# EAGLE schematic james_z80_debug_mod (EAGLE 7.7.0)

## Sheet 1 of 2: Main Board
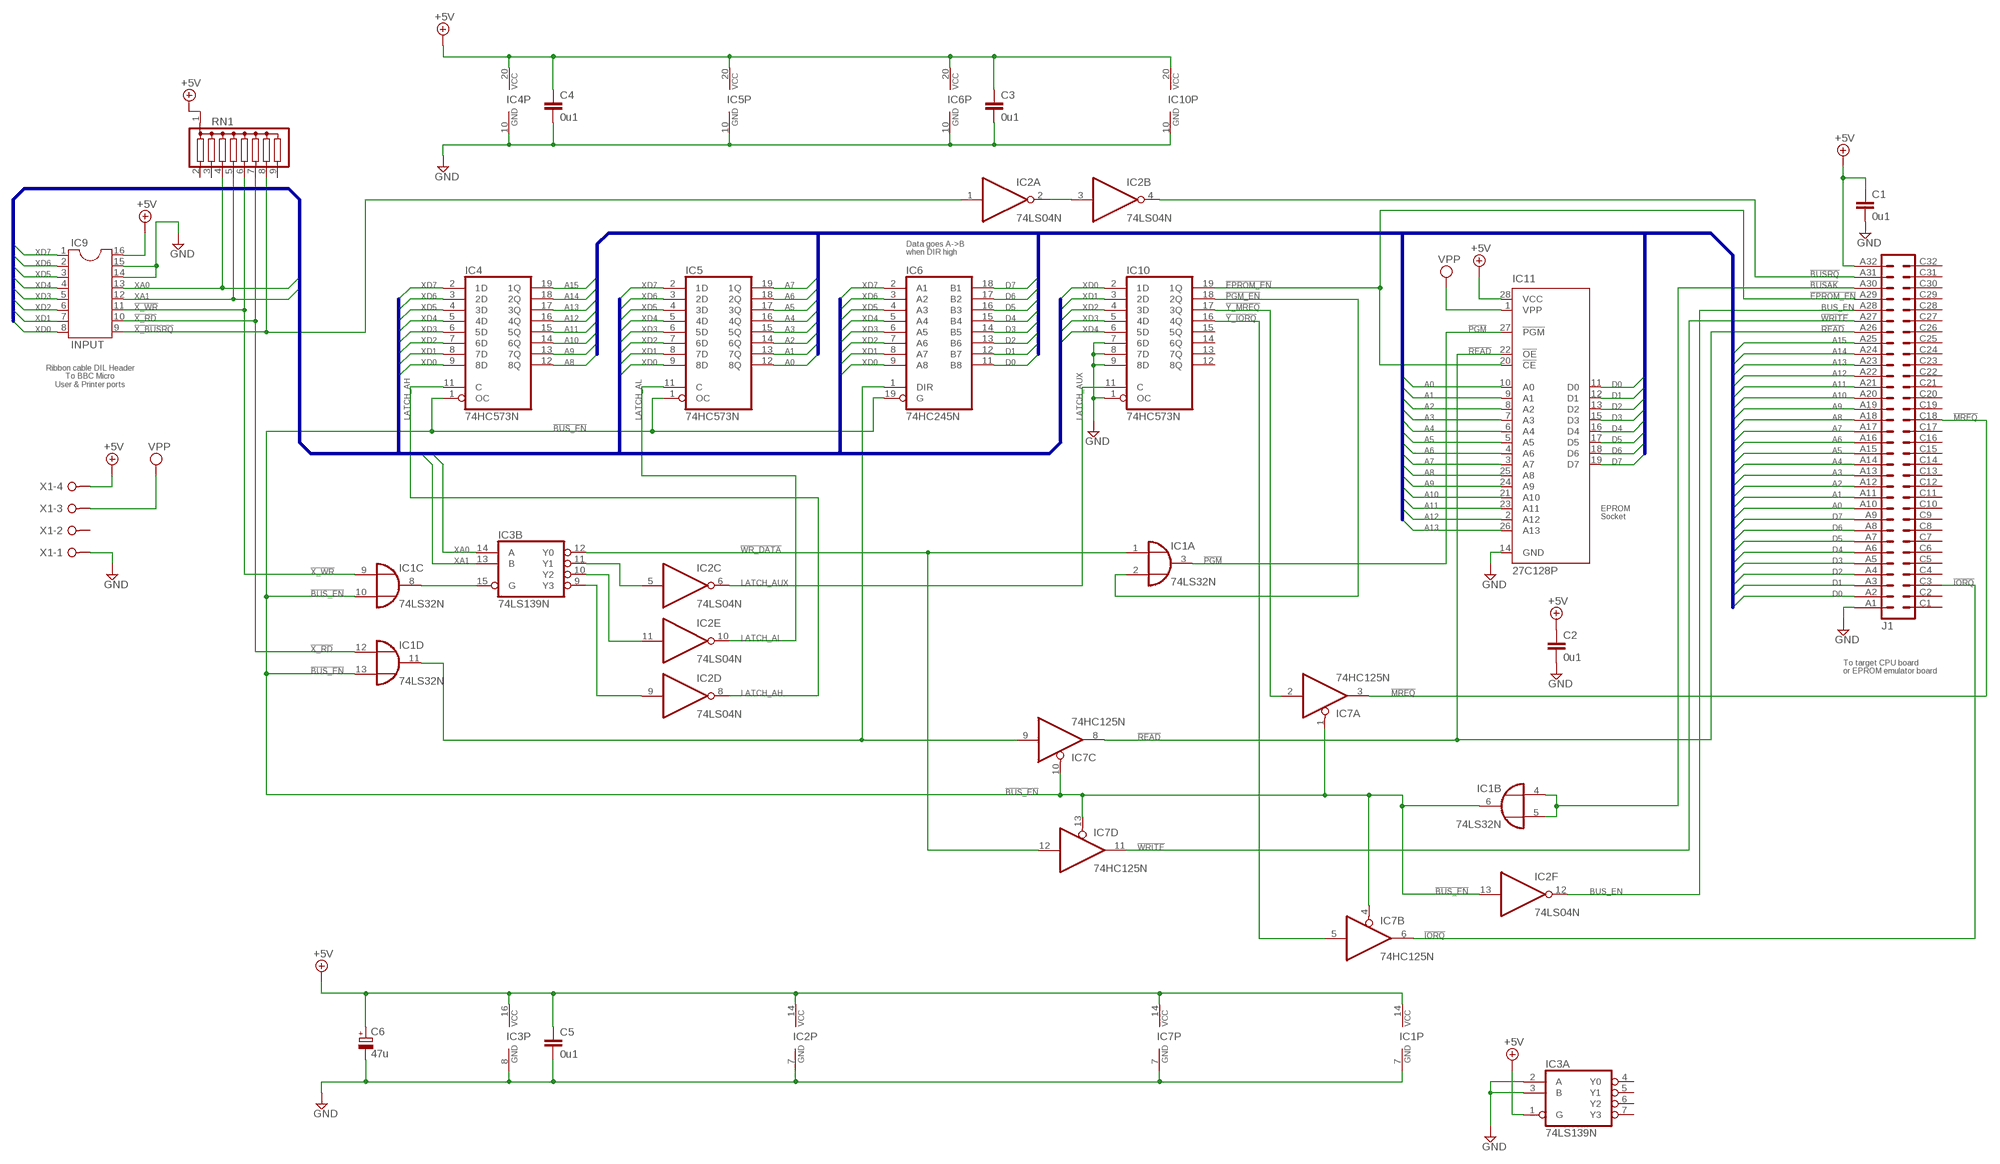
[diagram p0: schematic, sheet 1]

### Parts
C1  0u1  C-EU025-024X044  [C025-024X044]
C2  0u1  C-EU025-024X044  [C025-024X044]
C3  0u1  C-EU025-024X044  [C025-024X044]
C4  0u1  C-EU025-024X044  [C025-024X044]
C5  0u1  C-EU025-024X044  [C025-024X044]
C6  47u  CPOL-EUE2.5-5  [E2,5-5]
IC1  74LS32N  [DIL14]
IC2  74LS04N  [DIL14]
IC3  74LS139N  [DIL16]
IC4  74HC573N  [DIL20]
IC5  74HC573N  [DIL20]
IC6  74HC245N  [DIL20]
IC7  74HC125N  [DIL14]
IC9  INPUT  DIL16  [DIL16]
IC10  74HC573N  [DIL20]
IC11  27C128P  [DIL28-6]
J1  VG64B  [VG64B]
RN1  G08R  [SIL9]
X1  W237-04P  [W237-4P]

### Nets
!BUS_EN: IC1.6(B:O) IC1.10(C:I1) IC1.13(D:I1) IC2.13(F:I) IC4.1(OC) IC5.1(OC) IC6.19(G) IC7.1(A:OE) IC7.4(B:OE) IC7.10(C:OE) IC7.13(D:OE)
!BUSAK: IC1.4(B:I0) IC1.5(B:I1) J1.A30
!BUSRQ: IC2.4(B:O) J1.A31
!EPROM_EN: IC10.19(1Q) IC11.20(!CE) J1.A29 ; also sheet 2
!IORQ: IC7.6(B:O) J1.C3
!MREQ: IC7.3(A:O) J1.C18
!PGM: IC1.3(A:O) IC11.27(!PGM)
!PGM_EN: IC1.2(A:I1) IC10.18(2Q)
!READ: IC7.8(C:O) IC11.22(!OE) J1.A26 ; also sheet 2
!WR_DATA: IC1.1(A:I0) IC3.12(B:Y0) IC7.12(D:I)
!WRITE: IC7.11(D:O) J1.A27 ; also sheet 2
!X_BUSRQ: IC2.1(A:I) IC9.9 RN1.8
!X_RD: IC1.12(D:I0) IC9.10 RN1.7
!X_WR: IC1.9(C:I0) IC9.11 RN1.6
!Y_IORQ: IC7.5(B:I) IC10.16(4Q)
!Y_MREQ: IC7.2(A:I) IC10.17(3Q)
+5V: C1.1 C2.1 C3.1 C4.1 C5.1 C6.+ IC1.14(P:VCC) IC2.14(P:VCC) IC3.1(A:G) IC3.16(P:VCC) IC4.20(VCC) IC5.20(VCC) IC6.20(VCC) IC7.14(P:VCC) IC9.16 IC10.20(VCC) IC11.28(VCC) J1.A32 RN1.1 X1.4 ; also sheet 2
A0: IC5.12(8Q) IC11.10(A0) J1.A10 ; also sheet 2
A1: IC5.13(7Q) IC11.9(A1) J1.A11 ; also sheet 2
A2: IC5.14(6Q) IC11.8(A2) J1.A12 ; also sheet 2
A3: IC5.15(5Q) IC11.7(A3) J1.A13 ; also sheet 2
A4: IC5.16(4Q) IC11.6(A4) J1.A14 ; also sheet 2
A5: IC5.17(3Q) IC11.5(A5) J1.A15 ; also sheet 2
A6: IC5.18(2Q) IC11.4(A6) J1.A16 ; also sheet 2
A7: IC5.19(1Q) IC11.3(A7) J1.A17 ; also sheet 2
A8: IC4.12(8Q) IC11.25(A8) J1.A18 ; also sheet 2
A9: IC4.13(7Q) IC11.24(A9) J1.A19 ; also sheet 2
A10: IC4.14(6Q) IC11.21(A10) J1.A20 ; also sheet 2
A11: IC4.15(5Q) IC11.23(A11) J1.A21 ; also sheet 2
A12: IC4.16(4Q) IC11.2(A12) J1.A22 ; also sheet 2
A13: IC4.17(3Q) IC11.26(A13) J1.A23 ; also sheet 2
A14: IC4.18(2Q) J1.A24 ; also sheet 2
A15: IC4.19(1Q) J1.A25 ; also sheet 2
BUS_EN: IC2.12(F:O) J1.A28 ; also sheet 2
D0: IC6.11(B8) IC11.11(D0) J1.A2 ; also sheet 2
D1: IC6.12(B7) IC11.12(D1) J1.A3 ; also sheet 2
D2: IC6.13(B6) IC11.13(D2) J1.A4 ; also sheet 2
D3: IC6.14(B5) IC11.15(D3) J1.A5 ; also sheet 2
D4: IC6.15(B4) IC11.16(D4) J1.A6 ; also sheet 2
D5: IC6.16(B3) IC11.17(D5) J1.A7 ; also sheet 2
D6: IC6.17(B2) IC11.18(D6) J1.A8 ; also sheet 2
D7: IC6.18(B1) IC11.19(D7) J1.A9 ; also sheet 2
GND: C1.2 C2.2 C3.2 C4.2 C5.2 C6.- IC1.7(P:GND) IC2.7(P:GND) IC3.2(A:A) IC3.3(A:B) IC3.8(P:GND) IC4.10(GND) IC5.10(GND) IC6.10(GND) IC7.7(P:GND) IC9.14 IC9.15 IC10.1(OC) IC10.7(6D) IC10.8(7D) IC10.9(8D) IC10.10(GND) IC11.14(GND) J1.A1 X1.1 ; also sheet 2
LATCH_AH: IC2.8(D:O) IC4.11(C)
LATCH_AL: IC2.10(E:O) IC5.11(C)
LATCH_AUX: IC2.6(C:O) IC10.11(C)
N$3: IC2.2(A:O) IC2.3(B:I)
N$5: IC1.8(C:O) IC3.15(B:G)
N$9: IC1.11(D:O) IC6.1(DIR) IC7.9(C:I)
N$11: IC2.5(C:I) IC3.11(B:Y1)
N$12: IC2.11(E:I) IC3.10(B:Y2)
N$13: IC2.9(D:I) IC3.9(B:Y3)
VPP: IC11.1(VPP) X1.3
XA0: IC3.14(B:A) IC9.13 RN1.4
XA1: IC3.13(B:B) IC9.12 RN1.5
XD0: IC4.9(8D) IC5.9(8D) IC6.9(A8) IC9.8 IC10.2(1D)
XD1: IC4.8(7D) IC5.8(7D) IC6.8(A7) IC9.7 IC10.3(2D)
XD2: IC4.7(6D) IC5.7(6D) IC6.7(A6) IC9.6 IC10.4(3D)
XD3: IC4.6(5D) IC5.6(5D) IC6.6(A5) IC9.5 IC10.5(4D)
XD4: IC4.5(4D) IC5.5(4D) IC6.5(A4) IC9.4 IC10.6(5D)
XD5: IC4.4(3D) IC5.4(3D) IC6.4(A3) IC9.3
XD6: IC4.3(2D) IC5.3(2D) IC6.3(A2) IC9.2
XD7: IC4.2(1D) IC5.2(1D) IC6.2(A1) IC9.1
Unconnected: IC3.4(A:Y0) IC3.5(A:Y1) IC3.6(A:Y2) IC3.7(A:Y3) IC10.12(8Q) IC10.13(7Q) IC10.14(6Q) IC10.15(5Q) J1.C1 J1.C2 J1.C4 J1.C5 J1.C6 J1.C7 J1.C8 J1.C9 J1.C10 J1.C11 J1.C12 J1.C13 J1.C14 J1.C15 J1.C16 J1.C17 J1.C19 J1.C20 J1.C21 J1.C22 J1.C23 J1.C24 J1.C25 J1.C26 J1.C27 J1.C28 J1.C29 J1.C30 J1.C31 J1.C32 RN1.2 RN1.3 RN1.9 X1.2

### Buses
D[0..7],A[0..15]
XD[0..7],XA[0..1]

### Notes on the sheet
- Data goes A->B
  when DIR high
- Ribbon cable DIL Header
  To BBC Micro
  User & Printer ports
- EPROM
  Socket
- To target CPU board
  or EPROM emulator board

## Sheet 2 of 2: EPROM Emu
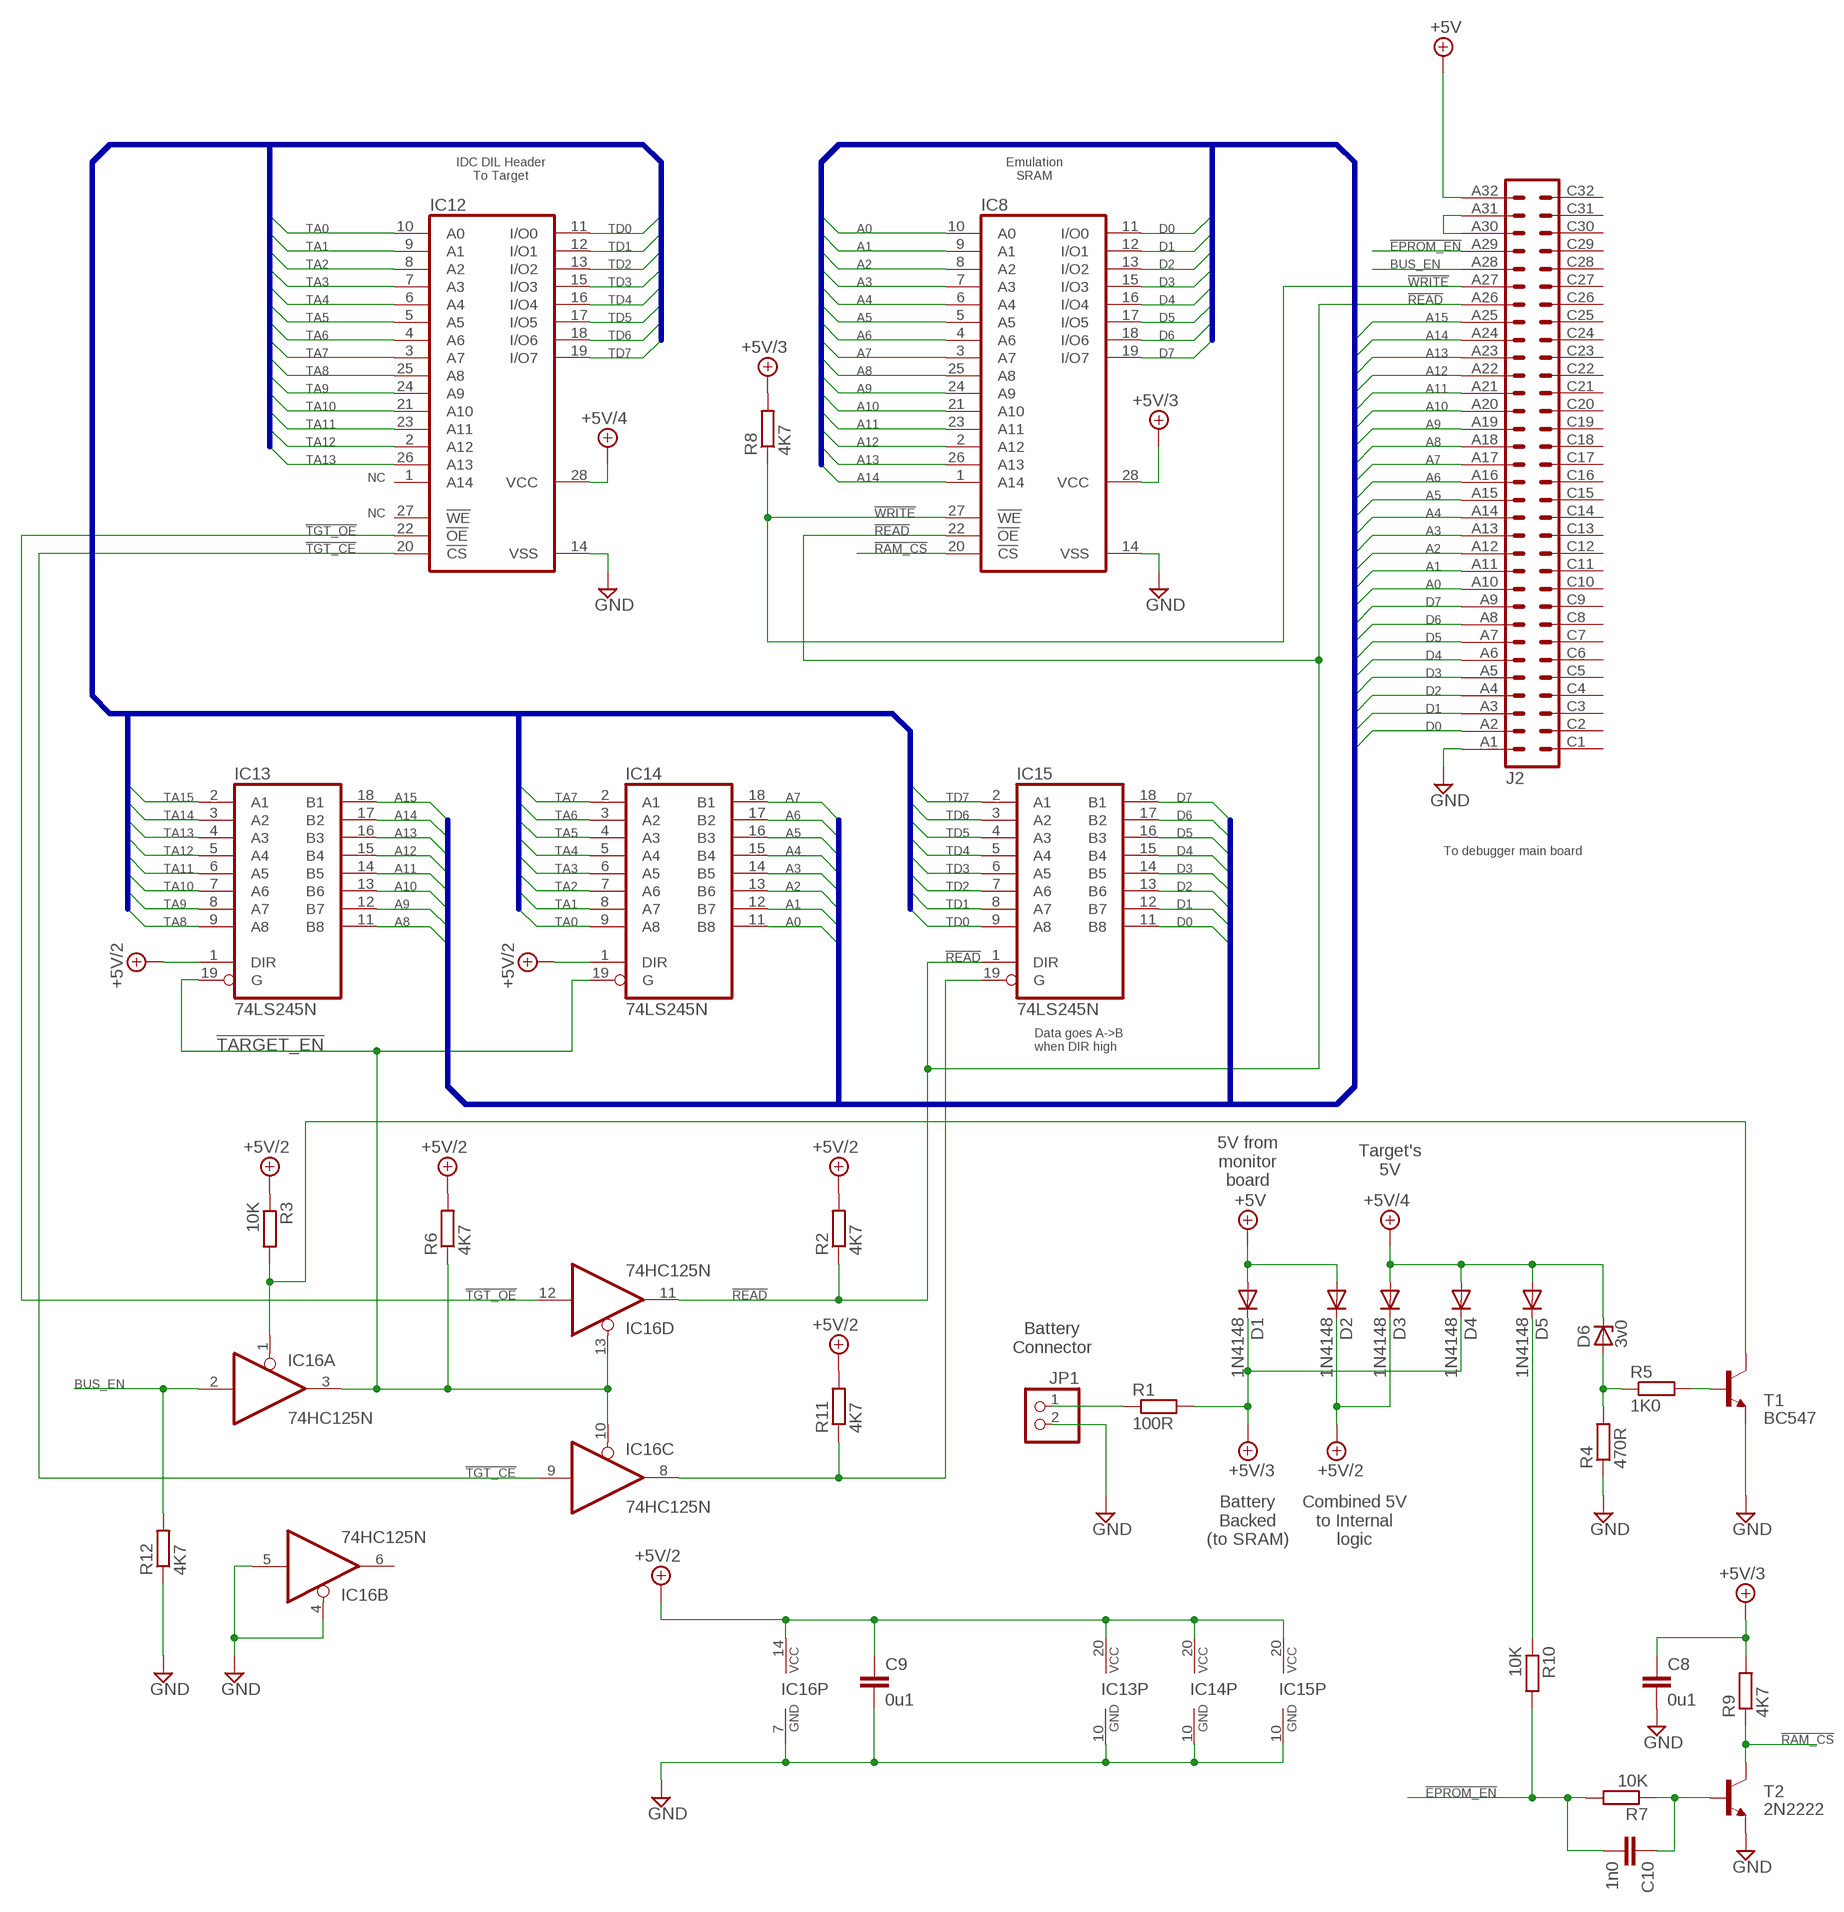
[diagram p1: schematic, sheet 2]

### Parts
C8  0u1  C-EU025-024X044  [C025-024X044]
C9  0u1  C-EU025-024X044  [C025-024X044]
C10  1n0  C-EU025-024X044  [C025-024X044]
D1  1N4148  1N4148DO35-7  [DO35-7]
D2  1N4148  1N4148DO35-7  [DO35-7]
D3  1N4148  1N4148DO35-7  [DO35-7]
D4  1N4148  1N4148DO35-7  [DO35-7]
D5  1N4148  1N4148DO35-7  [DO35-7]
D6  3v0  ZENER-DIODEF126-10  [F126Z10]
IC8  62256P  [DIL28-6]
IC12  62256P  [DIL28-6]
IC13  74LS245N  [DIL20]
IC14  74LS245N  [DIL20]
IC15  74LS245N  [DIL20]
IC16  74HC125N  [DIL14]
J2  VG64B  [VG64B]
JP1  PINHD-1X2  [1X02]
R1  100R  R-EU_0207/10  [0207/10]
R2  4K7  R-EU_0207/10  [0207/10]
R3  10K  R-EU_0207/2V  [0207/2V]
R4  470R  R-EU_0207/10  [0207/10]
R5  1K0  R-EU_0207/5V  [0207/5V]
R6  4K7  R-EU_0204/7  [0204/7]
R7  10K  R-EU_0207/5V  [0207/5V]
R8  4K7  R-EU_0207/2V  [0207/2V]
R9  4K7  R-EU_0207/2V  [0207/2V]
R10  10K  R-EU_0207/10  [0207/10]
R11  4K7  R-EU_0207/2V  [0207/2V]
R12  4K7  R-EU_0207/5V  [0207/5V]
T1  BC547  [TO92]
T2  2N2222  [TO18]

### Nets
!EPROM_EN: C10.2 J2.A29 R7.2 R10.2 ; also sheet 1
!RAM_CS: IC8.20(!CS) R9.1 T2.3(C)
!READ: IC8.22(!OE) IC15.1(DIR) IC16.11(D:O) J2.A26 R2.1 ; also sheet 1
!TARGET_EN: IC13.19(G) IC14.19(G) IC16.3(A:O) IC16.10(C:OE) IC16.13(D:OE) R6.1
!TGT_CE: IC12.20(!CS) IC16.9(C:I)
!TGT_OE: IC12.22(!OE) IC16.12(D:I)
!WRITE: IC8.27(!WE) J2.A27 R8.1 ; also sheet 1
+5V: D1.A D2.A J2.A32 ; also sheet 1
+5V/2: C9.1 D2.C D3.C IC13.1(DIR) IC13.20(VCC) IC14.1(DIR) IC14.20(VCC) IC15.20(VCC) IC16.14(P:VCC) R2.2 R3.1 R6.2 R11.2
+5V/3: C8.1 D1.C D4.C IC8.28(VCC) R1.2 R8.2 R9.2
+5V/4: D3.A D4.A D5.A D6.C IC12.28(VCC)
A0: IC8.10(A0) IC14.11(B8) J2.A10 ; also sheet 1
A1: IC8.9(A1) IC14.12(B7) J2.A11 ; also sheet 1
A2: IC8.8(A2) IC14.13(B6) J2.A12 ; also sheet 1
A3: IC8.7(A3) IC14.14(B5) J2.A13 ; also sheet 1
A4: IC8.6(A4) IC14.15(B4) J2.A14 ; also sheet 1
A5: IC8.5(A5) IC14.16(B3) J2.A15 ; also sheet 1
A6: IC8.4(A6) IC14.17(B2) J2.A16 ; also sheet 1
A7: IC8.3(A7) IC14.18(B1) J2.A17 ; also sheet 1
A8: IC8.25(A8) IC13.11(B8) J2.A18 ; also sheet 1
A9: IC8.24(A9) IC13.12(B7) J2.A19 ; also sheet 1
A10: IC8.21(A10) IC13.13(B6) J2.A20 ; also sheet 1
A11: IC8.23(A11) IC13.14(B5) J2.A21 ; also sheet 1
A12: IC8.2(A12) IC13.15(B4) J2.A22 ; also sheet 1
A13: IC8.26(A13) IC13.16(B3) J2.A23 ; also sheet 1
A14: IC8.1(A14) IC13.17(B2) J2.A24 ; also sheet 1
A15: IC13.18(B1) J2.A25 ; also sheet 1
BUS_EN: IC16.2(A:I) J2.A28 R12.2 ; also sheet 1
D0: IC8.11(I/O0) IC15.11(B8) J2.A2 ; also sheet 1
D1: IC8.12(I/O1) IC15.12(B7) J2.A3 ; also sheet 1
D2: IC8.13(I/O2) IC15.13(B6) J2.A4 ; also sheet 1
D3: IC8.15(I/O3) IC15.14(B5) J2.A5 ; also sheet 1
D4: IC8.16(I/O4) IC15.15(B4) J2.A6 ; also sheet 1
D5: IC8.17(I/O5) IC15.16(B3) J2.A7 ; also sheet 1
D6: IC8.18(I/O6) IC15.17(B2) J2.A8 ; also sheet 1
D7: IC8.19(I/O7) IC15.18(B1) J2.A9 ; also sheet 1
GND: C8.2 C9.2 IC8.14(VSS) IC12.14(VSS) IC13.10(GND) IC14.10(GND) IC15.10(GND) IC16.4(B:OE) IC16.5(B:I) IC16.7(P:GND) J2.A1 JP1.2 R4.1 R12.1 T1.1(E) T2.1(E) ; also sheet 1
N$1: D6.A R4.2 R5.1
N$2: IC16.1(A:OE) R3.2 T1.3(C)
N$6: J2.A30 J2.A31
N$7: IC15.19(G) IC16.8(C:O) R11.1
N$8: JP1.1 R1.1
N$10: R5.2 T1.2(B)
N$14: C10.1 R7.1 T2.2(B)
N$15: D5.C R10.1
TA0: IC12.10(A0) IC14.9(A8)
TA1: IC12.9(A1) IC14.8(A7)
TA2: IC12.8(A2) IC14.7(A6)
TA3: IC12.7(A3) IC14.6(A5)
TA4: IC12.6(A4) IC14.5(A4)
TA5: IC12.5(A5) IC14.4(A3)
TA6: IC12.4(A6) IC14.3(A2)
TA7: IC12.3(A7) IC14.2(A1)
TA8: IC12.25(A8) IC13.9(A8)
TA9: IC12.24(A9) IC13.8(A7)
TA10: IC12.21(A10) IC13.7(A6)
TA11: IC12.23(A11) IC13.6(A5)
TA12: IC12.2(A12) IC13.5(A4)
TA13: IC12.26(A13) IC13.4(A3)
TA14: IC13.3(A2)
TA15: IC13.2(A1)
TD0: IC12.11(I/O0) IC15.9(A8)
TD1: IC12.12(I/O1) IC15.8(A7)
TD2: IC12.13(I/O2) IC15.7(A6)
TD3: IC12.15(I/O3) IC15.6(A5)
TD4: IC12.16(I/O4) IC15.5(A4)
TD5: IC12.17(I/O5) IC15.4(A3)
TD6: IC12.18(I/O6) IC15.3(A2)
TD7: IC12.19(I/O7) IC15.2(A1)
Unconnected: IC12.1(A14) IC12.27(!WE) IC16.6(B:O) J2.C1 J2.C2 J2.C3 J2.C4 J2.C5 J2.C6 J2.C7 J2.C8 J2.C9 J2.C10 J2.C11 J2.C12 J2.C13 J2.C14 J2.C15 J2.C16 J2.C17 J2.C18 J2.C19 J2.C20 J2.C21 J2.C22 J2.C23 J2.C24 J2.C25 J2.C26 J2.C27 J2.C28 J2.C29 J2.C30 J2.C31 J2.C32

### Buses
D[0..7],A[0..15]
TD[0..7],TA[0..15]

### Notes on the sheet
- IDC DIL Header
  To Target
- Emulation
  SRAM
- NC
- NC
- To debugger main board
- Data goes A->B
  when DIR high
- Target's
  5V
- 5V from
  monitor
  board
- Battery
  Connector
- Battery
  Backed
  (to SRAM)
- Combined 5V
  to Internal
  logic

## Library data of the parts
C1-C5 C8-C10 = rcl:C-EU: CAPACITOR, European symbol
C6 = rcl:CPOL-EU: POLARIZED CAPACITOR, European symbol
D1-D5 = diode:1N4148: DIODE high speed (Philips)
D6 = diode:ZENER-DIODE: Z-Diode
IC1 = 74xx-eu:74*32: Quad 2-input OR gate
IC2 = 74xx-eu:74*04: Hex INVERTER
IC3 = 74xx-eu:74*139: Dual 2-line to 4-line DECODER/DEMULTIPLEXER
IC4 IC5 IC10 = 74xx-eu:74*573: 8-bit D latch BUS DRIVER
IC6 IC13-IC15 = 74xx-eu:74*245: Octal BUS TRANSCEIVER, 3-state
IC7 IC16 = 74xx-eu:74*125: Quad bus BUFFER, 3-state
IC8 IC12 = memory-hitachi:62256P: MEMORY; OC_FARNELL: unknown; OC_NEWARK: unknown
IC9 = ic-package:DIL16: Dual In Line / Socket
IC11 = microchip:27*128: CMOS EPROM 128 K (16 K x 8); OC_FARNELL: unknown; OC_NEWARK: unknown
J1 J2 = 19inch:VG64: PCB EUROCARD, 64-pin type C/AC, 2.54 mm
JP1 = pinhead:PINHD-1X2: PIN HEADER
R1-R12 = rcl:R-EU_: RESISTOR, European symbol
RN1 = resistor-sil:G08R: SIL RESISTOR; OC_FARNELL: unknown; OC_NEWARK: unknown
T1 = transistor:BC547: NPN TRANSISTOR
T2 = transistor:2N2222: NPN TRANSISTOR
X1 = con-wago-508:W237-04P: WAGO SREW CLAMP; OC_FARNELL: unknown; OC_NEWARK: unknown